# Altium schematic sheet PSU.SchDoc
size A3; PageSetup: Record=PageOptions|CenterHorizontal=True|CenterVertical=True|PrintScale=1.28|XCorrection=1.00|YCorrection=1.00|PrintKind=0|BorderSize=5000000|LeftOffset=0|BottomOffset=0|Orientation=2|PaperLength=1000|PaperWidth=1000|Scale=100|PaperSource=7|PrintQuality=-4|MediaType=1|DitherType=10|PaperKind=A3 297x420mm|PrintScaleMode=1; Organization: Electronic Research & Design; Address1: 11 Granofier; Address2: Zwartkop; Address3: Centurion; Address4: South Africa
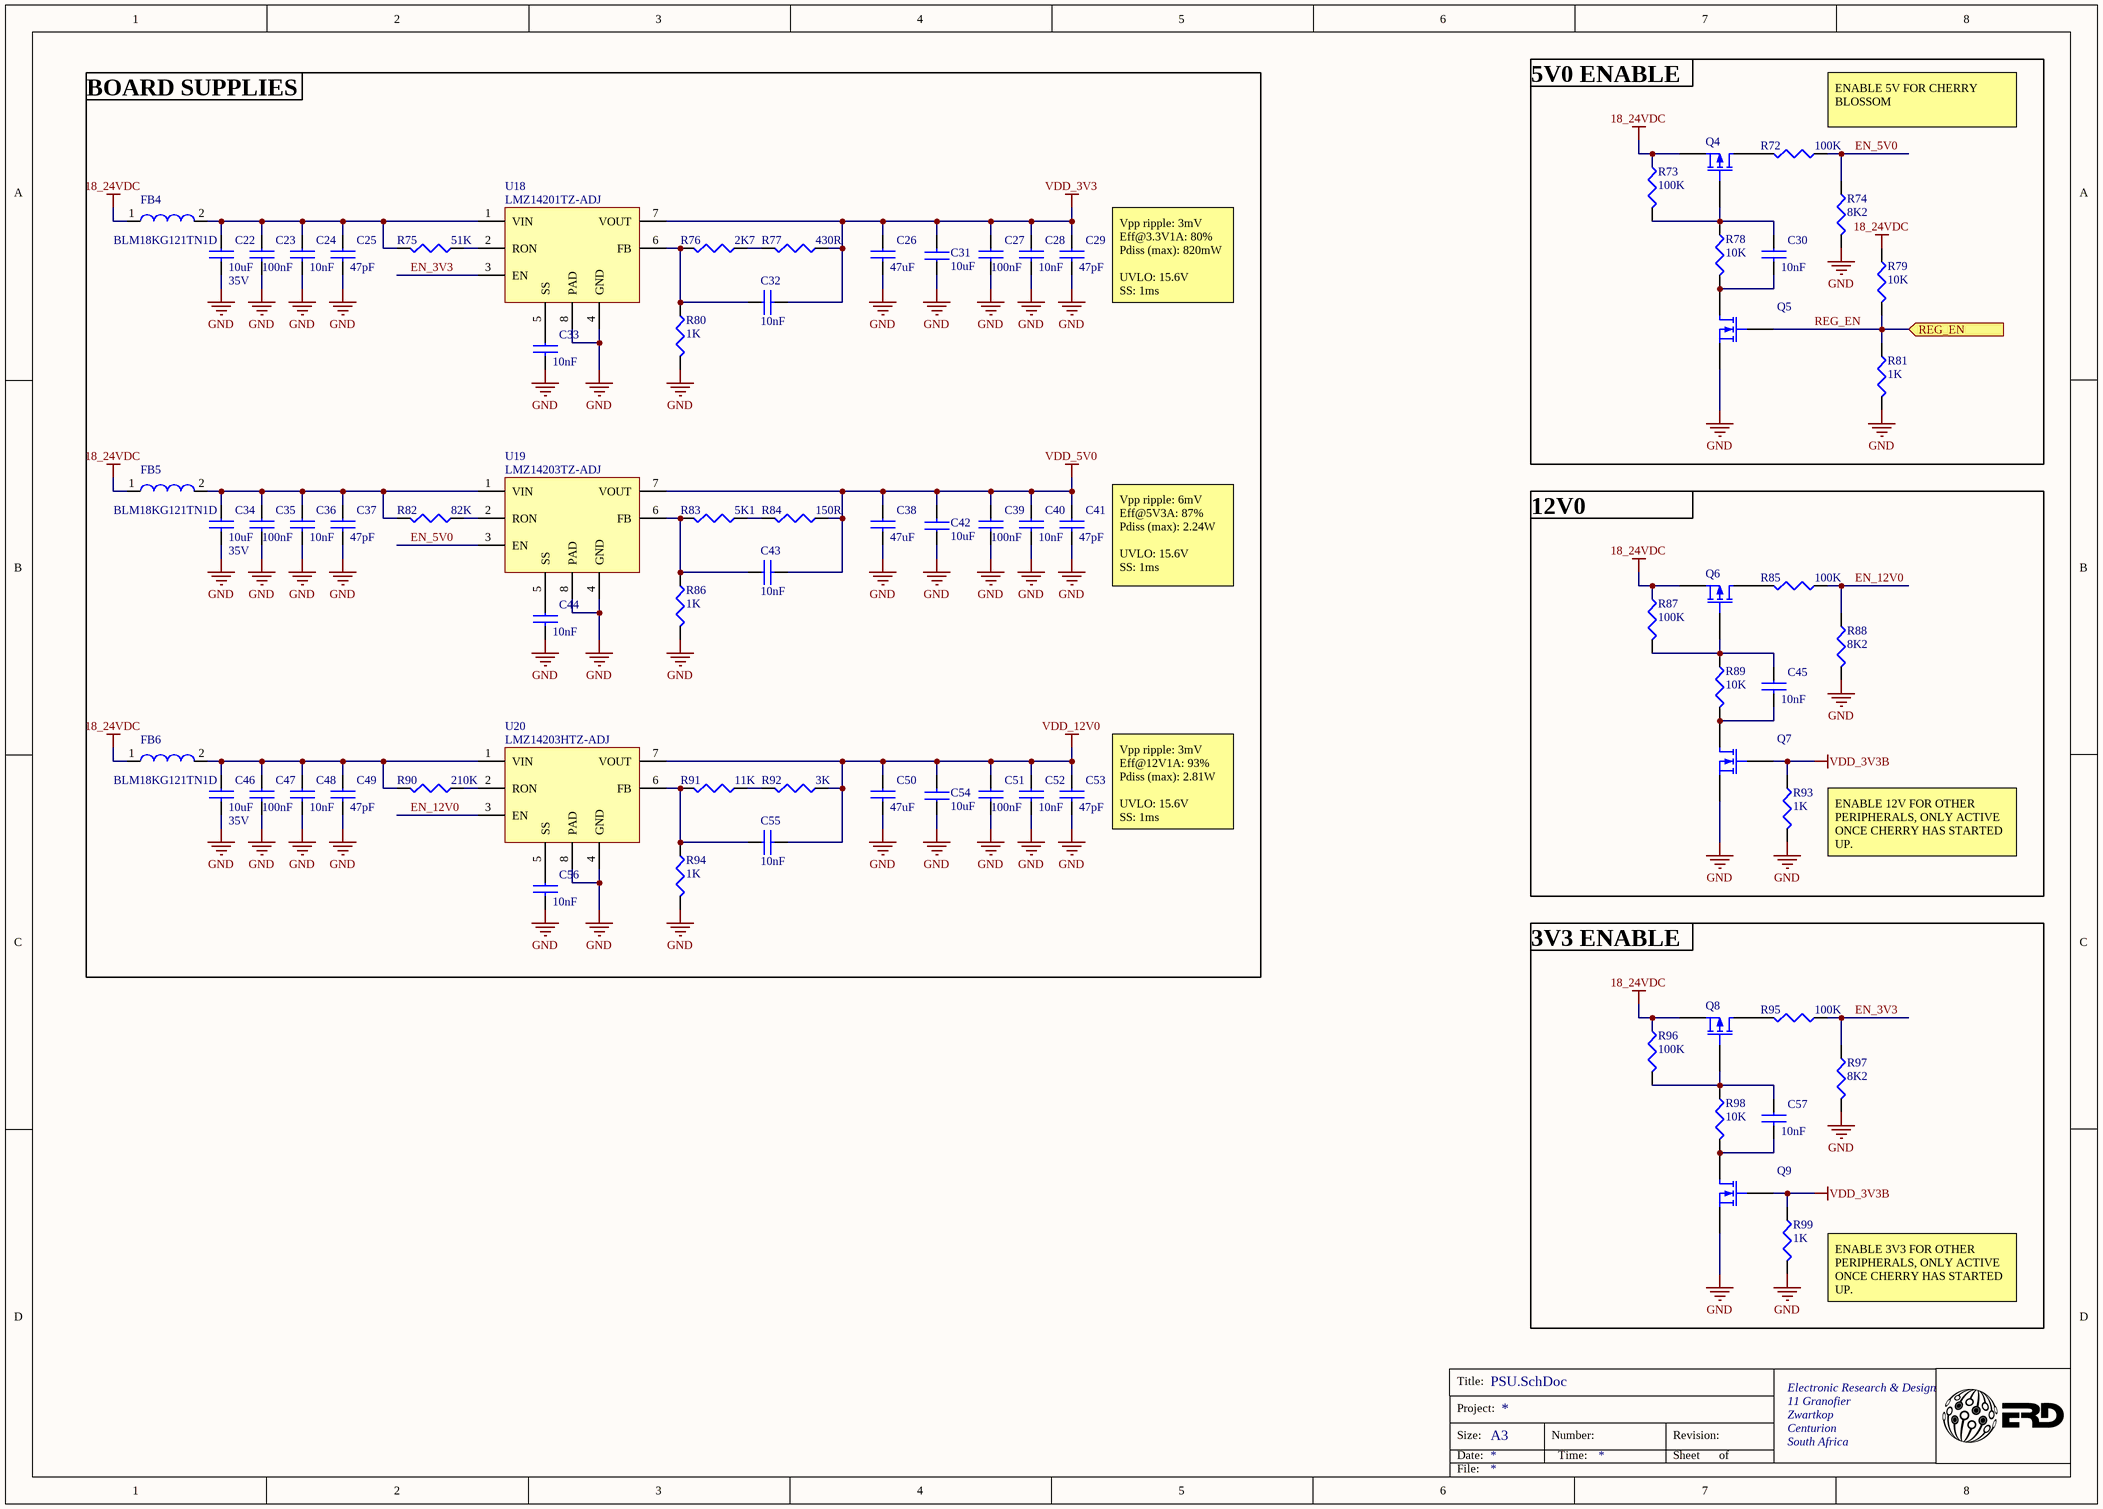
[diagram p0: PSU.SchDoc]

## Parts
C22  10uF  Voltage Rating: 35V  [CC0805]
C23  100nF  [CC0402]
C24  10nF  [CC0402]
C25  47pF  [CC0402]
C26  47uF  [RC1206]
C27  100nF  [CC0402]
C28  10nF  [CC0402]
C29  47pF  [CC0402]
C30  10nF  [CC0402]
C31  10uF  [CC0603]
C32  10nF  [CC0402]
C33  10nF  [CC0402]
C34  10uF  Voltage Rating: 35V  [CC0805]
C35  100nF  [CC0402]
C36  10nF  [CC0402]
C37  47pF  [CC0402]
C38  47uF  [RC1206]
C39  100nF  [CC0402]
C40  10nF  [CC0402]
C41  47pF  [CC0402]
C42  10uF  [CC0603]
C43  10nF  [CC0402]
C44  10nF  [CC0402]
C45  10nF  [CC0402]
C46  10uF  Voltage Rating: 35V  [CC0805]
C47  100nF  [CC0402]
C48  10nF  [CC0402]
C49  47pF  [CC0402]
C50  47uF  [RC1206]
C51  100nF  [CC0402]
C52  10nF  [CC0402]
C53  47pF  [CC0402]
C54  10uF  [CC0603]
C55  10nF  [CC0402]
C56  10nF  [CC0402]
C57  10nF  [CC0402]
FB4  BLM18KG121TN1D  [LC0603]
FB5  BLM18KG121TN1D  [LC0603]
FB6  BLM18KG121TN1D  [LC0603]
Q4  MOSFET-P  [E3]  (value not drawn)
Q5  BSS214NWH6327XTSA1  [SOT323]  (value not drawn)
Q6  MOSFET-P  [E3]  (value not drawn)
Q7  BSS214NWH6327XTSA1  [SOT323]  (value not drawn)
Q8  MOSFET-P  [E3]  (value not drawn)
Q9  BSS214NWH6327XTSA1  [SOT323]  (value not drawn)
R72  100K  [RC0402]
R73  100K  [RC0402]
R74  8K2  [RC0402]
R75  51K  [RC0402]
R76  2K7  [RC0402]
R77  430R  [RC0402]
R78  10K  [RC0402]
R79  10K  [RC0402]
R80  1K  [RC0402]
R81  1K  [RC0402]
R82  82K  [RC0402]
R83  5K1  [RC0402]
R84  150R  [RC0402]
R85  100K  [RC0402]
R86  1K  [RC0402]
R87  100K  [RC0402]
R88  8K2  [RC0402]
R89  10K  [RC0402]
R90  210K  [RC0402]
R91  11K  [RC0402]
R92  3K  [RC0402]
R93  1K  [RC0402]
R94  1K  [RC0402]
R95  100K  [RC0402]
R96  100K  [RC0402]
R97  8K2  [RC0402]
R98  10K  [RC0402]
R99  1K  [RC0402]
U18  LMZ14201TZ-ADJ  [TZA07A]
U19  LMZ14203TZ-ADJ  [TZA07A]
U20  LMZ14203HTZ-ADJ  [TZA07A]

## Ports
REG_EN (in)

## Nets
18_24VDC: FB4.1 FB5.1 FB6.1 Q4.3(S) Q6.3(S) Q8.3(S) R73.1 R79.1 R87.1 R96.1
GND: C22.2 C23.2 C24.2 C25.2 C26.2 C27.2 C28.2 C29.2 C31.1 C33.2 C34.2 C35.2 C36.2 C37.2 C38.2 C39.2 C40.2 C41.2 C42.1 C44.2 C46.2 C47.2 C48.2 C49.2 C50.2 C51.2 C52.2 C53.2 C54.1 C56.2 Q5.3(S) Q7.3(S) Q9.3(S) R74.2 R80.2 R81.2 R86.2 R88.2 R93.2 R94.2 R97.2 R99.2 U18.4(GND) U18.8(PAD) U19.4(GND) U19.8(PAD) U20.4(GND) U20.8(PAD)
VDD_3V3: C26.1 C27.1 C28.1 C29.1 C31.2 C32.2 R77.1 U18.7(VOUT)
VDD_3V3B: Q7.2(G) Q9.2(G) R93.1 R99.1
VDD_5V0: C38.1 C39.1 C40.1 C41.1 C42.2 C43.2 R84.1 U19.7(VOUT)
VDD_12V0: C50.1 C51.1 C52.1 C53.1 C54.2 C55.2 R92.1 U20.7(VOUT)
EN_3V3: R95.1 R97.1 U18.3(EN)
EN_5V0: R72.1 R74.1 U19.3(EN)
EN_12V0: R85.1 R88.1 U20.3(EN)
REG_EN: Q5.2(G) R79.2 R81.1 ; port REG_EN
NetC22_1: C22.1 C23.1 C24.1 C25.1 FB4.2 R75.2 U18.1(VIN)
NetC30_1: C30.1 Q4.2(G) R73.2 R78.1
NetC30_2: C30.2 Q5.1(D) R78.2
NetC32_1: C32.1 R76.2 R80.1 U18.6(FB)
NetC33_1: C33.1 U18.5(SS)
NetC34_1: C34.1 C35.1 C36.1 C37.1 FB5.2 R82.2 U19.1(VIN)
NetC43_1: C43.1 R83.2 R86.1 U19.6(FB)
NetC44_1: C44.1 U19.5(SS)
NetC45_1: C45.1 Q6.2(G) R87.2 R89.1
NetC45_2: C45.2 Q7.1(D) R89.2
NetC46_1: C46.1 C47.1 C48.1 C49.1 FB6.2 R90.2 U20.1(VIN)
NetC55_1: C55.1 R91.2 R94.1 U20.6(FB)
NetC56_1: C56.1 U20.5(SS)
NetC57_1: C57.1 Q8.2(G) R96.2 R98.1
NetC57_2: C57.2 Q9.1(D) R98.2
NetQ4_1: Q4.1(D) R72.2
NetQ6_1: Q6.1(D) R85.2
NetQ8_1: Q8.1(D) R95.2
NetR75_1: R75.1 U18.2(RON)
NetR76_1: R76.1 R77.2
NetR82_1: R82.1 U19.2(RON)
NetR83_1: R83.1 R84.2
NetR90_1: R90.1 U20.2(RON)
NetR91_1: R91.1 R92.2

## Notes on the sheet
- BOARD SUPPLIES
- 5V0 ENABLE
- (near R72) ENABLE 5V FOR CHERRY BLOSSOM
- (near C29) Vpp ripple: 3mV
  Eff@3.3V1A: 80%
  Pdiss (max): 820mW
  UVLO: 15.6V
  SS: 1ms
- 12V0 ENABLE
- (near C41) Vpp ripple: 6mV
  Eff@5V3A: 87%
  Pdiss (max): 2.24W
  UVLO: 15.6V
  SS: 1ms
- (near C53) Vpp ripple: 3mV
  Eff@12V1A: 93%
  Pdiss (max): 2.81W
  UVLO: 15.6V
  SS: 1ms
- (near R93) ENABLE 12V FOR OTHER PERIPHERALS, ONLY ACTIVE ONCE CHERRY HAS STARTED UP.
- 3V3 ENABLE
- (near R99) ENABLE 3V3 FOR OTHER PERIPHERALS, ONLY ACTIVE ONCE CHERRY HAS STARTED UP.
- Title:
- Size:
- Date:
- Project:
- A3
- Number:
- Time:
- Revision:
- Sheet
- of
- File:

## Library data of the parts
C22 C34 C46 = CAP CER 0.1UF 10V 10% X5R 0402: CAP CER 10UF 35V 10% X5R 0805; Manufacturer: Murata; Part Number: GRM21BR6YA106KE43L; Package / Case: 0805
C23 C27 C35 C39 C47 C51 = CAP CER 0.1UF 10V 10% X5R 0402: CAP CER 0.1UF 50V 10% X7R 0402; Manufacturer: Murata; Part Number: GCM155R71H104KE02D; Package / Case: 0402 (1005 Metric); Supplier: AAD
C24 C28 C30 C32 C33 C36 C40 C43-C45 C48 C52 C55-C57 = CAP CER 0.1UF 10V 10% X5R 0402: CAP CER 10NF 50V 10% X7R 0402; Manufacturer: Murata; Part Number: GRM155R71H103KA88J; Package / Case: 0402; Voltage Rating: 50V
C25 C29 C37 C41 C49 C53 = CAP CER 0.1UF 10V 10% X5R 0402: CAP CER 47PF 50V 5% C0G/NP0 0402; Manufacturer: Murata; Part Number: GCM1555C1H470JA16D; Package / Case: 0402; Voltage Rating: 50V
C26 C38 C50 = CAP CER 0.1UF 10V 10% X5R 0402: CAP CER 47UF 25V 20% X5R 1206; Manufacturer: Murata; Part Number: C3216X5R1E476M160AC; Package / Case: 1206; Voltage Rating: 25v
C31 C42 C54 = CAP CER 0.1UF 10V 10% X5R 0402: CAP CER 10UF 25V 20% X5R 0603; Manufacturer: Murata; PartNumber: GRM188R61E106MA73D; Package / Case: 0603; Supplier: AAD
FB4-FB6 = FER_180_200_0: FERRITE 3A 30mOHM 0603 SMD; PartNumber: BLM18KG121TN1D
Q4 Q6 Q8 = MOSFET-P: P-Channel MOSFET; Published: 8-Jun-2000; LatestRevisionDate: 17-Jul-2002; LatestRevisionNote: Re-released for DXP Platform.; PackageVersion: 1995/1996; PackageReference: E3; Publisher: Altium Limited; PackageDescription: TO, Flat Index; 3 In-Line, Axial Leads; Body Dia. 4.6mm; Lead Dia. 0.5 mm (max)
Q5 Q7 Q9 = MOSFET-N: N-Channel FET, 20V, 1.5A, 140mOhm, SOT323; pin to pad: 1>3 2>1 3>2; Published: 8-Jun-2000; LatestRevisionDate: 17-Jul-2002; LatestRevisionNote: Re-released for DXP Platform.; PackageVersion: 1995/1996; PackageReference: E3; Publisher: Altium Limited; PackageDescription: TO, Flat Index; 3 In-Line, Axial Leads; Body Dia. 4.6mm; Lead Dia. 0.5 mm (max); Part Number: BSS214NWH6327XTSA1
R72 R85 R95 = RES_10K_1/16W_1%_0402: RES, 100K OHM, 1/16W, 1%, 0402; Manufacturer: Yageo; PartNumber: RC0402FR-07100KL; Package / Case: 0402 (1005 Metric); Supplier: AAD
R73 R87 R96 = RES_10K_1/16W_1%_0402: RES, 100K OHM, 1/16W, 1%, 0402; Manufacturer: Yageo; Part Number: RC0402FR-07100KL; Package / Case: 0402 (1005 Metric); Supplier: AAD
R74 R88 R97 = RES_10K_1/16W_1%_0402: RES, 8K2 OHM, 1/16W, 1%, 0402; Manufacturer: Yageo; PartNumber: RC0402FR-078K2L; Package / Case: 0402 (1005 Metric); Supplier: AAD
R75 = RES_10K_1/16W_1%_0402: RES, 51K OHM, 1/16W, 1%, 0402; Manufacturer: Yageo; PartNumber: RC0402FR-0751KL; Package / Case: 0402 (1005 Metric); Supplier: AAD
R76 = RES_10K_1/16W_1%_0402: RES, 2K7 OHM, 1/16W, 1%, 0402; Manufacturer: Yageo; PartNumber: RC0402FR-072K7L; Package / Case: 0402 (1005 Metric); Supplier: AAD
R77 = RES_10K_1/16W_1%_0402: RES, 430 OHM, 1/16W, 1%, 0402; Manufacturer: Yageo; PartNumber: RC0402FR-07430RL; Package / Case: 0402 (1005 Metric); Supplier: AAD
R78 R79 R89 R98 = RES_10K_1/16W_1%_0402: RES, 10K OHM, 1/16W, 1%, 0402; Manufacturer: Yageo; Part Number: RC0402FR-0710KL; Package / Case: 0402 (1005 Metric); Supplier: AAD
R80 R81 R86 R93 R94 R99 = RES_10K_1/16W_1%_0402: RES, 1K OHM, 1/16W, 1%, 0402; Manufacturer: Yageo; PartNumber: RC0402FR-071KL; Package / Case: 0402 (1005 Metric); Supplier: AAD
R82 = RES_10K_1/16W_1%_0402: RES, 82K OHM, 1/16W, 1%, 0402; Manufacturer: Yageo; PartNumber: RC0402FR-0782KL; Package / Case: 0402 (1005 Metric); Supplier: AAD
R83 = RES_10K_1/16W_1%_0402: RES, 5K1 OHM, 1/16W, 1%, 0402; Manufacturer: Yageo; PartNumber: RC0402FR-075K1L; Package / Case: 0402 (1005 Metric); Supplier: AAD
R84 = RES_10K_1/16W_1%_0402: RES, 150 OHM, 1/16W, 1%, 0402; Manufacturer: Yageo; PartNumber: RC0402FR-07150RL; Package / Case: 0402 (1005 Metric); Supplier: AAD
R90 = RES_10K_1/16W_1%_0402: RES, 210K OHM, 1/16W, 1%, 0402; Manufacturer: Yageo; PartNumber: RC0402FR-07210KL; Package / Case: 0402 (1005 Metric); Supplier: AAD
R91 = RES_10K_1/16W_1%_0402: RES, 11K OHM, 1/16W, 1%, 0402; Manufacturer: Yageo; PartNumber: RC0402FR-0711KL; Package / Case: 0402 (1005 Metric); Supplier: AAD
R92 = RES_10K_1/16W_1%_0402: RES, 3K OHM, 1/16W, 1%, 0402; Manufacturer: Yageo; PartNumber: RC0402FR-073KL; Package / Case: 0402 (1005 Metric); Supplier: AAD
U18-U20 = LMZ14201: Buc Converter, SimpleSwitcher, 42V, 1A, TO-PMOD-7; Manufacturer: Texas Instruments
  U18: PartNumber: LMZ14201TZ-ADJ
  U19: PartNumber: LMZ14203TZ-ADJ
  U20: PartNumber: LMZ14203HTZ-ADJ